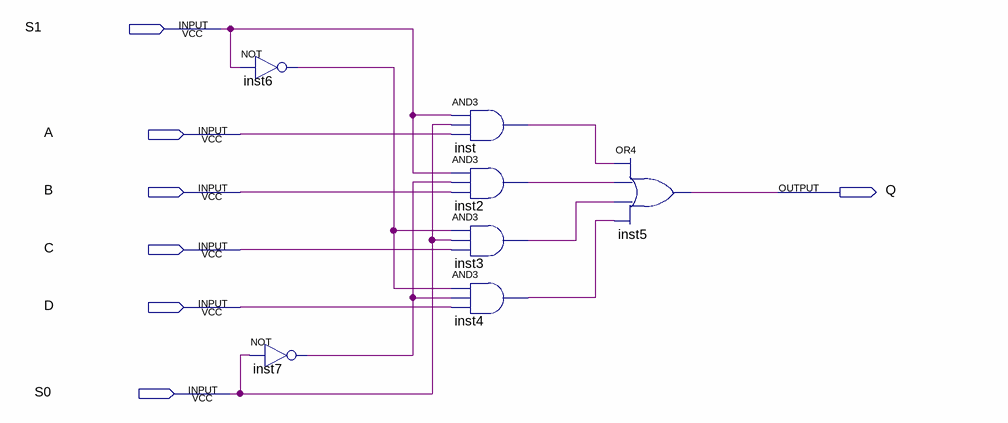
[diagram p0: schematic sheet]
// Quartus schematic Block2.bdf as structural Verilog: 7 symbols, 7 pins
module Block2 (
  input  S1,
  input  A,
  input  B,
  input  C,
  input  D,
  input  S0,
  output Q
);

  wire inst2_out, inst3_out, inst4_out, inst6_out, inst7_out, inst_out;

  not inst6 (inst6_out, S1);
  not inst7 (inst7_out, S0);
  and inst (inst_out, S1, S0, A);
  and inst2 (inst2_out, S1, inst7_out, B);
  and inst3 (inst3_out, inst6_out, S0, C);
  and inst4 (inst4_out, inst6_out, inst7_out, D);
  or inst5 (Q, inst_out, inst2_out, inst3_out, inst4_out);
endmodule
